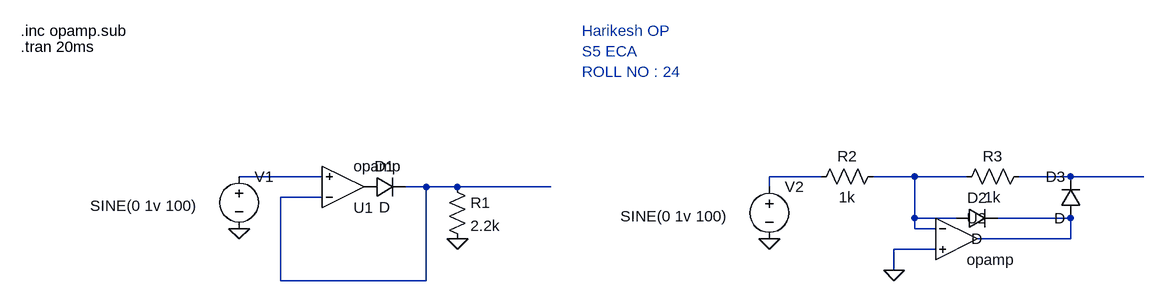
[diagram p0: schematic HALF_WAVE.asc]
HALF_WAVE.asc, the LTspice schematic file:
Version 4
SHEET 1 1940 680
WIRE 672 400 544 400
WIRE 1440 400 1360 400
WIRE 1584 400 1520 400
WIRE 1664 400 1584 400
WIRE 1824 400 1744 400
WIRE 1936 400 1824 400
WIRE 832 416 800 416
WIRE 880 416 832 416
WIRE 1024 416 880 416
WIRE 1360 416 1360 400
WIRE 672 432 608 432
WIRE 1584 464 1584 400
WIRE 1648 464 1584 464
WIRE 1824 464 1712 464
WIRE 1584 480 1584 464
WIRE 1616 480 1584 480
WIRE 1824 496 1824 464
WIRE 1824 496 1680 496
WIRE 1616 512 1552 512
WIRE 1552 544 1552 512
WIRE 608 560 608 432
WIRE 832 560 832 416
WIRE 832 560 608 560
FLAG 544 480 0
FLAG 880 496 0
FLAG 1360 496 0
FLAG 1552 544 0
SYMBOL OpAmps\\opamp 704 480 M180
SYMATTR InstName U1
SYMBOL voltage 544 384 R0
WINDOW 3 -229 61 Left 2
WINDOW 123 0 0 Left 0
WINDOW 39 0 0 Left 0
SYMATTR InstName V1
SYMATTR Value SINE(0 1v 100)
SYMBOL diode 736 432 R270
WINDOW 0 32 32 VTop 2
WINDOW 3 0 32 VBottom 2
SYMATTR InstName D1
SYMBOL res 864 400 R0
SYMATTR InstName R1
SYMATTR Value 2.2k
SYMBOL OpAmps\\opamp 1648 432 R0
SYMATTR InstName U2
SYMBOL voltage 1360 400 R0
WINDOW 3 -229 61 Left 2
WINDOW 123 0 0 Left 0
WINDOW 39 0 0 Left 0
SYMATTR InstName V2
SYMATTR Value SINE(0 1v 100)
SYMBOL res 1536 384 R90
WINDOW 0 0 56 VBottom 2
WINDOW 3 32 56 VTop 2
SYMATTR InstName R2
SYMATTR Value 1k
SYMBOL res 1760 384 R90
WINDOW 0 0 56 VBottom 2
WINDOW 3 32 56 VTop 2
SYMATTR InstName R3
SYMATTR Value 1k
SYMBOL diode 1648 480 R270
WINDOW 0 32 32 VTop 2
WINDOW 3 0 32 VBottom 2
SYMATTR InstName D2
SYMBOL diode 1840 464 R180
WINDOW 0 24 64 Left 2
WINDOW 3 24 0 Left 2
SYMATTR InstName D3
TEXT 208 176 Left 2 !.inc opamp.sub
TEXT 208 200 Left 2 !.tran 20ms
TEXT 1072 176 Left 2 ;Harikesh OP\nS5 ECA \nROLL NO : 24

The netlist it stands for:
* HALF_WAVE.asc
XU1 N005 N001 P001 opamp Aol=100K GBW=10Meg  ; pins invin noninvin out
V1 N001 0 SINE(0 1v 100)
D1 P001 N005 D
R1 N005 0 2.2k
XU2 N003 0 N006 opamp Aol=100K GBW=10Meg  ; pins invin noninvin out
V2 N002 0 SINE(0 1v 100)
R2 N003 N002 1k
R3 N004 N003 1k
D2 N003 N006 D
D3 N006 N004 D
.model D D
.lib standard.dio
.inc opamp.sub
.tran 20ms
* Harikesh OP
* S5 ECA
* ROLL NO : 24
.backanno
.end